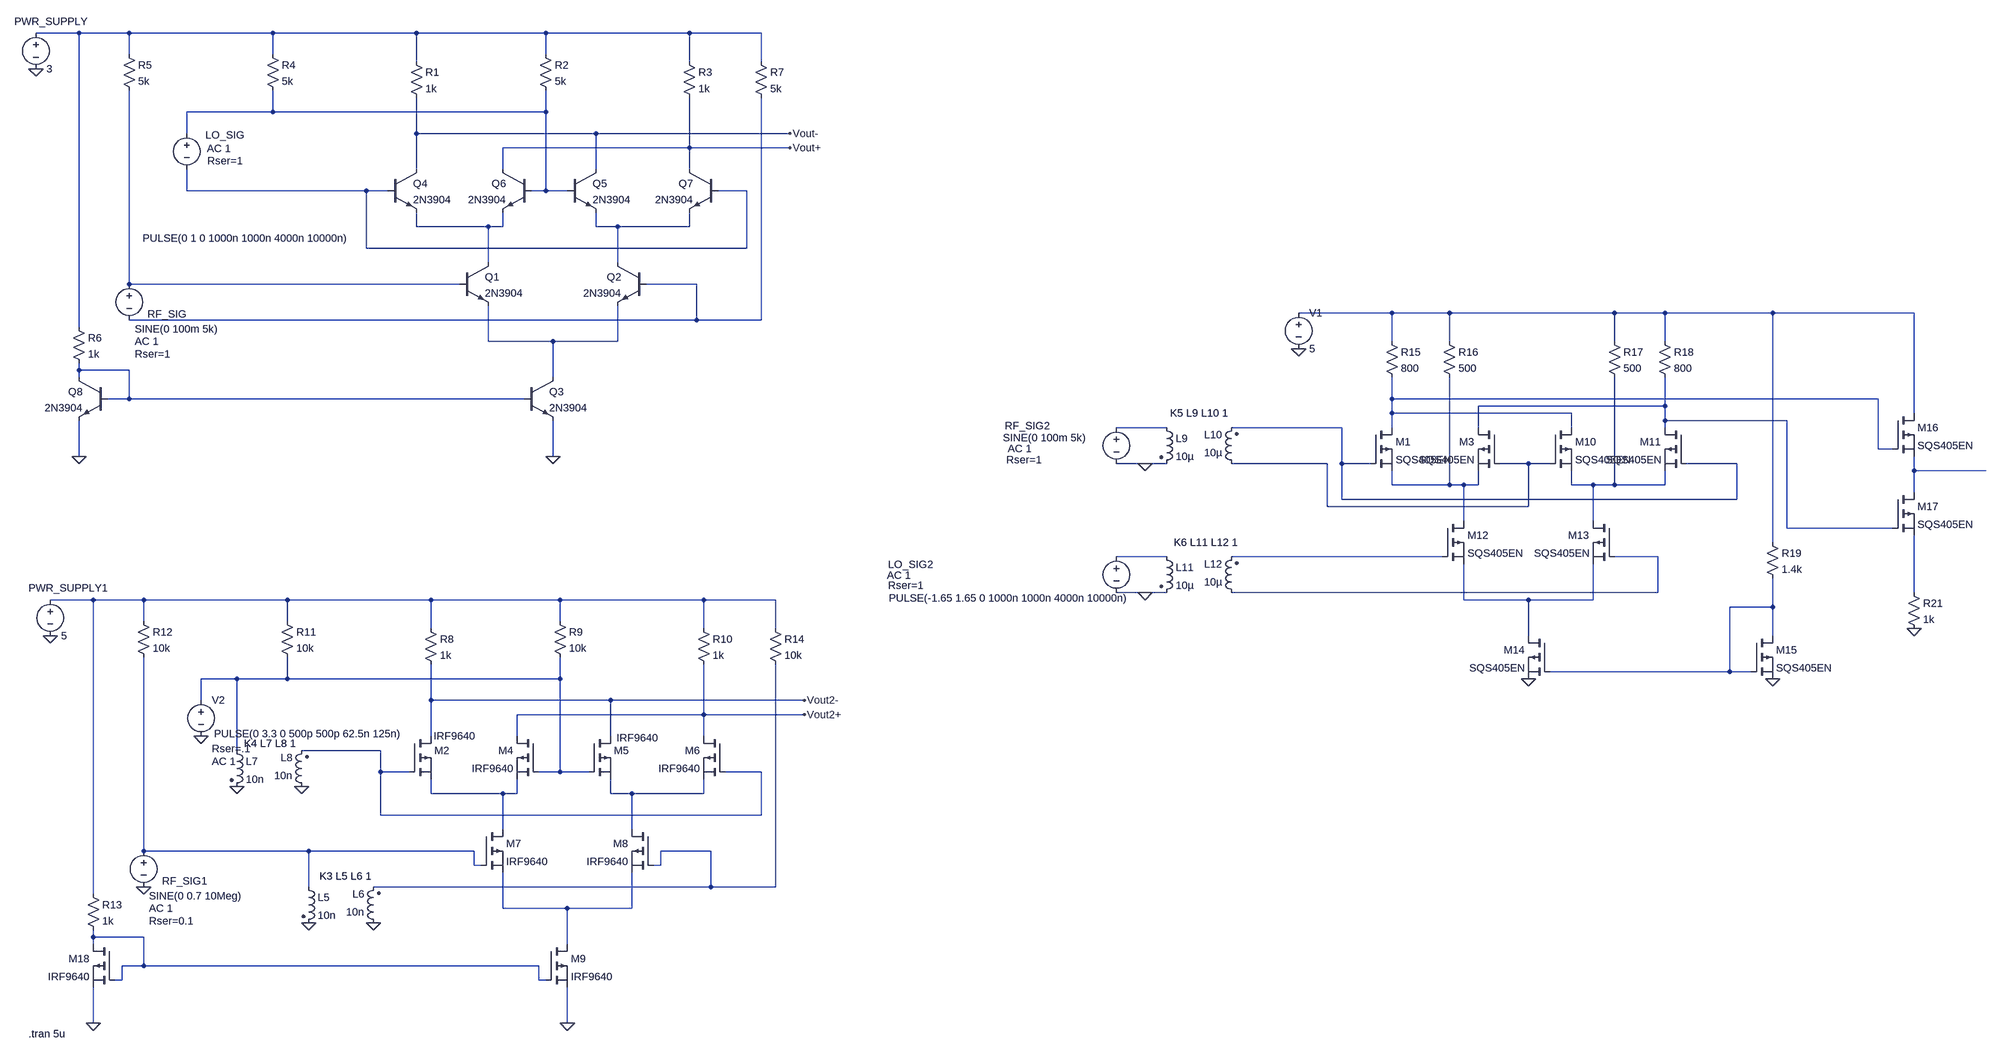
[diagram p0: schematic Gilbert Cell (MARCH_07_2025).asc]
Gilbert Cell (MARCH_07_2025).asc, the LTspice schematic file:
Version 4
SHEET 1 3612 2168
WIRE -752 -400 -848 -400
WIRE -640 -400 -752 -400
WIRE -320 -400 -640 -400
WIRE 0 -400 -320 -400
WIRE 288 -400 0 -400
WIRE 608 -400 288 -400
WIRE 768 -400 608 -400
WIRE -640 -352 -640 -400
WIRE -320 -352 -320 -400
WIRE 288 -352 288 -400
WIRE 0 -336 0 -400
WIRE 608 -336 608 -400
WIRE 768 -336 768 -400
WIRE -320 -224 -320 -272
WIRE -320 -224 -512 -224
WIRE 288 -224 288 -272
WIRE 288 -224 -320 -224
WIRE -512 -176 -512 -224
WIRE 0 -176 0 -256
WIRE 400 -176 0 -176
WIRE 832 -176 400 -176
WIRE 608 -144 608 -256
WIRE 608 -144 192 -144
WIRE 832 -144 608 -144
WIRE 0 -96 0 -176
WIRE 192 -96 192 -144
WIRE 400 -96 400 -176
WIRE 608 -96 608 -144
WIRE -512 -48 -512 -96
WIRE -112 -48 -512 -48
WIRE -64 -48 -112 -48
WIRE 288 -48 288 -224
WIRE 288 -48 256 -48
WIRE 336 -48 288 -48
WIRE 736 -48 672 -48
WIRE 0 32 0 0
WIRE 160 32 0 32
WIRE 192 32 192 0
WIRE 192 32 160 32
WIRE 400 32 400 0
WIRE 448 32 400 32
WIRE 608 32 608 0
WIRE 608 32 448 32
WIRE -112 80 -112 -48
WIRE 736 80 736 -48
WIRE 736 80 -112 80
WIRE 160 112 160 32
WIRE 448 112 448 32
WIRE -640 160 -640 -272
WIRE 96 160 -640 160
WIRE 624 160 512 160
WIRE 2240 224 2032 224
WIRE 2368 224 2240 224
WIRE 2736 224 2368 224
WIRE 2848 224 2736 224
WIRE 3088 224 2848 224
WIRE 3408 224 3088 224
WIRE 624 240 624 160
WIRE 624 240 -640 240
WIRE 768 240 768 -256
WIRE 768 240 624 240
WIRE -752 256 -752 -400
WIRE 160 288 160 208
WIRE 304 288 160 288
WIRE 448 288 448 208
WIRE 448 288 304 288
WIRE 2240 288 2240 224
WIRE 2368 288 2368 224
WIRE 2736 288 2736 224
WIRE 2848 288 2848 224
WIRE -752 352 -752 336
WIRE -640 352 -752 352
WIRE -752 368 -752 352
WIRE 304 368 304 288
WIRE -640 416 -640 352
WIRE -640 416 -688 416
WIRE 240 416 -640 416
WIRE 2240 416 2240 368
WIRE 3328 416 2240 416
WIRE 2848 432 2848 368
WIRE 2848 432 2432 432
WIRE 2240 448 2240 416
WIRE 2640 448 2240 448
WIRE 3408 448 3408 224
WIRE 2848 464 2848 432
WIRE 3120 464 2848 464
WIRE 1728 480 1616 480
WIRE 2128 480 1872 480
WIRE 2240 480 2240 448
WIRE 2432 480 2432 432
WIRE 2640 480 2640 448
WIRE 2848 480 2848 464
WIRE 3328 528 3328 416
WIRE 3360 528 3328 528
WIRE -752 544 -752 464
WIRE 304 544 304 464
WIRE 1680 560 1616 560
WIRE 1728 560 1680 560
WIRE 2096 560 1872 560
WIRE 2128 560 2128 480
WIRE 2192 560 2128 560
WIRE 2544 560 2480 560
WIRE 2592 560 2544 560
WIRE 3008 560 2896 560
WIRE 3408 576 3408 544
WIRE 3568 576 3408 576
WIRE 2240 608 2240 576
WIRE 2368 608 2368 368
WIRE 2368 608 2240 608
WIRE 2400 608 2368 608
WIRE 2432 608 2432 576
WIRE 2432 608 2400 608
WIRE 2640 608 2640 576
WIRE 2688 608 2640 608
WIRE 2736 608 2736 368
WIRE 2736 608 2688 608
WIRE 2848 608 2848 576
WIRE 2848 608 2736 608
WIRE 3408 624 3408 576
WIRE 2128 640 2128 560
WIRE 3008 640 3008 560
WIRE 3008 640 2128 640
WIRE 2096 656 2096 560
WIRE 2544 656 2544 560
WIRE 2544 656 2096 656
WIRE 2400 688 2400 608
WIRE 2688 688 2688 608
WIRE 3120 704 3120 464
WIRE 3360 704 3120 704
WIRE 3088 736 3088 224
WIRE 1728 768 1616 768
WIRE 2352 768 1872 768
WIRE 2832 768 2736 768
WIRE 1680 848 1616 848
WIRE 1728 848 1680 848
WIRE 2832 848 2832 768
WIRE 2832 848 1872 848
WIRE 3408 848 3408 720
WIRE -720 864 -816 864
WIRE -608 864 -720 864
WIRE -288 864 -608 864
WIRE 32 864 -288 864
WIRE 320 864 32 864
WIRE 640 864 320 864
WIRE 800 864 640 864
WIRE 2400 864 2400 784
WIRE 2544 864 2400 864
WIRE 2688 864 2688 784
WIRE 2688 864 2544 864
WIRE 3088 880 3088 816
WIRE 3088 880 2992 880
WIRE -608 912 -608 864
WIRE -288 912 -288 864
WIRE 320 912 320 864
WIRE 32 928 32 864
WIRE 640 928 640 864
WIRE 800 928 800 864
WIRE 2544 944 2544 864
WIRE 3088 944 3088 880
WIRE 2992 1024 2992 880
WIRE 2992 1024 2592 1024
WIRE 3040 1024 2992 1024
WIRE -400 1040 -480 1040
WIRE -288 1040 -288 992
WIRE -288 1040 -400 1040
WIRE 320 1040 320 992
WIRE 320 1040 -288 1040
WIRE -480 1088 -480 1040
WIRE 32 1088 32 1008
WIRE 432 1088 32 1088
WIRE 864 1088 432 1088
WIRE 640 1120 640 1008
WIRE 640 1120 224 1120
WIRE 864 1120 640 1120
WIRE 32 1168 32 1088
WIRE 224 1168 224 1120
WIRE 432 1168 432 1088
WIRE 640 1168 640 1120
WIRE -400 1200 -400 1040
WIRE -80 1200 -256 1200
WIRE -80 1248 -80 1200
WIRE -16 1248 -80 1248
WIRE 320 1248 320 1040
WIRE 320 1248 272 1248
WIRE 384 1248 320 1248
WIRE 768 1248 688 1248
WIRE 32 1296 32 1264
WIRE 192 1296 32 1296
WIRE 224 1296 224 1264
WIRE 224 1296 192 1296
WIRE 432 1296 432 1264
WIRE 480 1296 432 1296
WIRE 640 1296 640 1264
WIRE 640 1296 480 1296
WIRE -80 1344 -80 1248
WIRE 768 1344 768 1248
WIRE 768 1344 -80 1344
WIRE 192 1376 192 1296
WIRE 480 1376 480 1296
WIRE -608 1424 -608 992
WIRE -240 1424 -608 1424
WIRE 128 1424 -240 1424
WIRE 656 1424 544 1424
WIRE 128 1456 128 1424
WIRE 144 1456 128 1456
WIRE 544 1456 544 1424
WIRE 544 1456 528 1456
WIRE -240 1504 -240 1424
WIRE 656 1504 656 1424
WIRE 656 1504 -96 1504
WIRE 800 1504 800 1008
WIRE 800 1504 656 1504
WIRE -720 1520 -720 864
WIRE 192 1552 192 1472
WIRE 336 1552 192 1552
WIRE 480 1552 480 1472
WIRE 480 1552 336 1552
WIRE -720 1616 -720 1600
WIRE -608 1616 -720 1616
WIRE -720 1632 -720 1616
WIRE 336 1632 336 1552
WIRE -608 1680 -608 1616
WIRE -608 1680 -656 1680
WIRE 272 1680 -608 1680
WIRE -656 1712 -656 1680
WIRE -656 1712 -672 1712
WIRE 272 1712 272 1680
WIRE 288 1712 272 1712
WIRE -720 1808 -720 1728
WIRE 336 1808 336 1728
FLAG 304 544 0
FLAG 832 -176 Vout-
FLAG 832 -144 Vout+
FLAG -848 -320 0
FLAG -752 544 0
FLAG 336 1808 0
FLAG 864 1088 Vout2-
FLAG 864 1120 Vout2+
FLAG -816 944 0
FLAG -720 1808 0
FLAG -608 1504 0
FLAG -240 1584 0
FLAG -96 1584 0
FLAG -400 1280 0
FLAG -256 1280 0
FLAG -480 1168 0
FLAG 1680 560 0
FLAG 1680 848 0
FLAG 2544 1040 0
FLAG 3088 1040 0
FLAG 2032 304 0
FLAG 3408 928 0
SYMBOL npn 96 112 R0
SYMATTR InstName Q1
SYMATTR Value 2N3904
SYMBOL npn 512 112 M0
SYMATTR InstName Q2
SYMATTR Value 2N3904
SYMBOL npn 240 368 R0
SYMATTR InstName Q3
SYMATTR Value 2N3904
SYMBOL npn -64 -96 R0
SYMATTR InstName Q4
SYMATTR Value 2N3904
SYMBOL npn 336 -96 R0
SYMATTR InstName Q5
SYMATTR Value 2N3904
SYMBOL npn 256 -96 M0
SYMATTR InstName Q6
SYMATTR Value 2N3904
SYMBOL npn 672 -96 M0
SYMATTR InstName Q7
SYMATTR Value 2N3904
SYMBOL res -16 -352 R0
SYMATTR InstName R1
SYMATTR Value 1k
SYMBOL res 272 -368 R0
SYMATTR InstName R2
SYMATTR Value 5k
SYMBOL res 592 -352 R0
SYMATTR InstName R3
SYMATTR Value 1k
SYMBOL voltage -512 -192 R0
WINDOW 0 42 20 Left 2
WINDOW 3 -98 250 Left 2
WINDOW 123 45 50 Left 2
WINDOW 39 46 77 Left 2
SYMATTR InstName LO_SIG
SYMATTR Value PULSE(0 1 0 1000n 1000n 4000n 10000n)
SYMATTR Value2 AC 1
SYMATTR SpiceLine Rser=1
SYMBOL res -336 -368 R0
SYMATTR InstName R4
SYMATTR Value 5k
SYMBOL res -656 -368 R0
SYMATTR InstName R5
SYMATTR Value 5k
SYMBOL res -768 240 R0
SYMATTR InstName R6
SYMATTR Value 1k
SYMBOL voltage -848 -416 R0
WINDOW 0 -48 -10 Left 2
WINDOW 123 0 0 Left 0
WINDOW 39 0 0 Left 0
SYMATTR InstName PWR_SUPPLY
SYMATTR Value 3
SYMBOL npn -688 368 M0
SYMATTR InstName Q8
SYMATTR Value 2N3904
SYMBOL voltage -640 144 R0
WINDOW 0 41 83 Left 2
WINDOW 3 12 116 Left 2
WINDOW 123 12 144 Left 2
WINDOW 39 12 172 Left 2
SYMATTR InstName RF_SIG
SYMATTR Value SINE(0 100m 5k)
SYMATTR Value2 AC 1
SYMATTR SpiceLine Rser=1
SYMBOL res 752 -352 R0
SYMATTR InstName R7
SYMATTR Value 5k
SYMBOL res 16 912 R0
SYMATTR InstName R8
SYMATTR Value 1k
SYMBOL res 304 896 R0
SYMATTR InstName R9
SYMATTR Value 10k
SYMBOL res 624 912 R0
SYMATTR InstName R10
SYMATTR Value 1k
SYMBOL res -304 896 R0
SYMATTR InstName R11
SYMATTR Value 10k
SYMBOL res -624 896 R0
SYMATTR InstName R12
SYMATTR Value 10k
SYMBOL res -736 1504 R0
SYMATTR InstName R13
SYMATTR Value 1k
SYMBOL voltage -816 848 R0
WINDOW 0 -48 -10 Left 2
WINDOW 123 0 0 Left 0
WINDOW 39 0 0 Left 0
SYMATTR InstName PWR_SUPPLY1
SYMATTR Value 5
SYMBOL voltage -608 1408 R0
WINDOW 0 41 83 Left 2
WINDOW 3 12 116 Left 2
WINDOW 123 12 144 Left 2
WINDOW 39 12 172 Left 2
SYMATTR InstName RF_SIG1
SYMATTR Value SINE(0 0.7 10Meg)
SYMATTR Value2 AC 1
SYMATTR SpiceLine Rser=0.1
SYMBOL res 784 912 R0
SYMATTR InstName R14
SYMATTR Value 10k
SYMBOL ind2 -256 1488 R0
SYMATTR InstName L5
SYMATTR Value 10n
SYMATTR Type ind
SYMBOL ind2 -80 1600 R180
WINDOW 0 36 80 Left 2
WINDOW 3 36 40 Left 2
SYMATTR InstName L6
SYMATTR Value 10n
SYMATTR Type ind
SYMBOL ind2 -416 1184 R0
SYMATTR InstName L7
SYMATTR Value 10n
SYMATTR Type ind
SYMBOL ind2 -240 1296 R180
WINDOW 0 36 80 Left 2
WINDOW 3 36 40 Left 2
SYMATTR InstName L8
SYMATTR Value 10n
SYMATTR Type ind
SYMBOL pmos -16 1168 R0
WINDOW 3 54 0 Left 2
SYMATTR InstName M2
SYMATTR Value IRF9640
SYMBOL pmos 272 1168 M0
SYMATTR InstName M4
SYMATTR Value IRF9640
SYMBOL pmos 384 1168 R0
WINDOW 3 62 4 Left 2
SYMATTR InstName M5
SYMATTR Value IRF9640
SYMBOL pmos 688 1168 M0
SYMATTR InstName M6
SYMATTR Value IRF9640
SYMBOL pmos 144 1376 R0
SYMATTR InstName M7
SYMATTR Value IRF9640
SYMBOL pmos 528 1376 M0
SYMATTR InstName M8
SYMATTR Value IRF9640
SYMBOL pmos 288 1632 R0
SYMATTR InstName M9
SYMATTR Value IRF9640
SYMBOL ind2 1712 464 R0
SYMATTR InstName L9
SYMATTR Value 10µ
SYMATTR Type ind
SYMBOL ind2 1888 576 R180
WINDOW 0 36 80 Left 2
WINDOW 3 36 40 Left 2
SYMATTR InstName L10
SYMATTR Value 10µ
SYMATTR Type ind
SYMBOL ind2 1712 752 R0
SYMATTR InstName L11
SYMATTR Value 10µ
SYMATTR Type ind
SYMBOL ind2 1888 864 R180
WINDOW 0 36 80 Left 2
WINDOW 3 36 40 Left 2
SYMATTR InstName L12
SYMATTR Value 10µ
SYMATTR Type ind
SYMBOL voltage 1616 752 R0
WINDOW 0 -509 33 Left 2
WINDOW 3 -507 108 Left 2
WINDOW 123 -511 57 Left 2
WINDOW 39 -509 80 Left 2
SYMATTR InstName LO_SIG2
SYMATTR Value PULSE(-1.65 1.65 0 1000n 1000n 4000n 10000n)
SYMATTR Value2 AC 1
SYMATTR SpiceLine Rser=1
SYMBOL voltage 1616 464 R0
WINDOW 0 -249 12 Left 2
WINDOW 3 -253 39 Left 2
WINDOW 123 -242 63 Left 2
WINDOW 39 -245 88 Left 2
SYMATTR InstName RF_SIG2
SYMATTR Value SINE(0 100m 5k)
SYMATTR Value2 AC 1
SYMATTR SpiceLine Rser=1
SYMBOL pmos 2192 480 R0
SYMATTR InstName M1
SYMATTR Value SQS405EN
SYMBOL pmos 2480 480 M0
SYMATTR InstName M3
SYMATTR Value SQS405EN
SYMBOL pmos 2592 480 R0
SYMATTR InstName M10
SYMATTR Value SQS405EN
SYMBOL pmos 2896 480 M0
SYMATTR InstName M11
SYMATTR Value SQS405EN
SYMBOL pmos 2352 688 R0
SYMATTR InstName M12
SYMATTR Value SQS405EN
SYMBOL pmos 2736 688 M0
SYMATTR InstName M13
SYMATTR Value SQS405EN
SYMBOL pmos 2592 944 M0
SYMATTR InstName M14
SYMATTR Value SQS405EN
SYMBOL pmos 3040 944 R0
SYMATTR InstName M15
SYMATTR Value SQS405EN
SYMBOL res 2224 272 R0
SYMATTR InstName R15
SYMATTR Value 800
SYMBOL res 2352 272 R0
SYMATTR InstName R16
SYMATTR Value 500
SYMBOL res 2720 272 R0
SYMATTR InstName R17
SYMATTR Value 500
SYMBOL res 2832 272 R0
SYMATTR InstName R18
SYMATTR Value 800
SYMBOL voltage 2032 208 R0
WINDOW 123 0 0 Left 0
WINDOW 39 0 0 Left 0
SYMATTR InstName V1
SYMATTR Value 5
SYMBOL res 3072 720 R0
SYMATTR InstName R19
SYMATTR Value 1.4k
SYMBOL res 3392 832 R0
SYMATTR InstName R21
SYMATTR Value 1k
SYMBOL pmos 3360 448 R0
SYMATTR InstName M16
SYMATTR Value SQS405EN
SYMBOL pmos 3360 624 R0
SYMATTR InstName M17
SYMATTR Value SQS405EN
SYMBOL pmos -672 1632 M0
SYMATTR InstName M18
SYMATTR Value IRF9640
SYMBOL voltage -480 1072 R0
WINDOW 3 29 91 Left 2
WINDOW 123 24 152 Left 2
WINDOW 39 24 124 Left 2
SYMATTR InstName V2
SYMATTR Value PULSE(0 3.3 0 500p 500p 62.5n 125n)
SYMATTR Value2 AC 1
SYMATTR SpiceLine Rser=.1
TEXT -864 1832 Left 2 !.tran 5u
TEXT -216 1480 Left 2 !K3 L5 L6 1
TEXT -384 1184 Left 2 !K4 L7 L8 1
TEXT 1736 448 Left 2 !K5 L9 L10 1
TEXT 1744 736 Left 2 !K6 L11 L12 1

The netlist it stands for:
* Gilbert Cell (MARCH_07_2025).asc
Q1 N004 N006 N009 0 2N3904
Q2 N005 N007 N009 0 2N3904
Q3 N009 N010 0 0 2N3904
Q4 Vout- N003 N004 0 2N3904
Q5 Vout- N002 N005 0 2N3904
Q6 Vout+ N002 N004 0 2N3904
Q7 Vout+ N003 N005 0 2N3904
R1 N001 Vout- 1k
R2 N001 N002 5k
R3 N001 Vout+ 1k
V§LO_SIG N002 N003 PULSE(0 1 0 1000n 1000n 4000n 10000n) AC 1 Rser=1
R4 N001 N002 5k
R5 N001 N006 5k
R6 N001 N010 1k
V§PWR_SUPPLY N001 0 3
Q8 N010 N010 0 0 2N3904
V§RF_SIG N006 N007 SINE(0 100m 5k) AC 1 Rser=1
R7 N001 N007 5k
R8 N023 Vout2- 1k
R9 N023 N026 10k
R10 N023 Vout2+ 1k
R11 N023 N026 10k
R12 N023 N030 10k
R13 N023 N033 1k
V§PWR_SUPPLY1 N023 0 5
V§RF_SIG1 N030 0 SINE(0 0.7 10Meg) AC 1 Rser=0.1
R14 N023 N031 10k
L5 N030 0 10n
L6 0 N031 10n
L7 N026 0 10n
L8 0 N027 10n
M2 Vout2- N027 N028 N028 IRF9640
M4 Vout2+ N026 N028 N028 IRF9640
M5 Vout2- N026 N029 N029 IRF9640
M6 Vout2+ N027 N029 N029 IRF9640
M7 N028 N030 N032 N032 IRF9640
M8 N029 N031 N032 N032 IRF9640
M9 N032 N033 0 0 IRF9640
L9 N013 0 10µ
L10 N015 N014 10µ
L11 N019 0 10µ
L12 N021 N020 10µ
V§LO_SIG2 N019 0 PULSE(-1.65 1.65 0 1000n 1000n 4000n 10000n) AC 1 Rser=1
V§RF_SIG2 N013 0 SINE(0 100m 5k) AC 1 Rser=1
M1 N011 N014 N017 N017 SQS405EN
M3 N012 N015 N017 N017 SQS405EN
M10 N011 N015 N018 N018 SQS405EN
M11 N012 N014 N018 N018 SQS405EN
M12 N017 N020 N024 N024 SQS405EN
M13 N018 N021 N024 N024 SQS405EN
M14 N024 N025 0 0 SQS405EN
M15 N025 N025 0 0 SQS405EN
R15 N008 N011 800
R16 N008 N017 500
R17 N008 N018 500
R18 N008 N012 800
V1 N008 0 5
R19 N008 N025 1.4k
R21 N022 0 1k
M16 N008 N011 N016 N016 SQS405EN
M17 N016 N012 N022 N022 SQS405EN
M18 N033 N033 0 0 IRF9640
V2 N026 0 PULSE(0 3.3 0 500p 500p 62.5n 125n) AC 1 Rser=.1
.model NPN NPN
.model PNP PNP
.lib standard.bjt
.model NMOS NMOS
.model PMOS PMOS
.lib standard.mos
.tran 5u
K3 L5 L6 1
K4 L7 L8 1
K5 L9 L10 1
K6 L11 L12 1
.backanno
.end